# EAGLE design 2te4x230_In_3.4 (EAGLE 5.00)
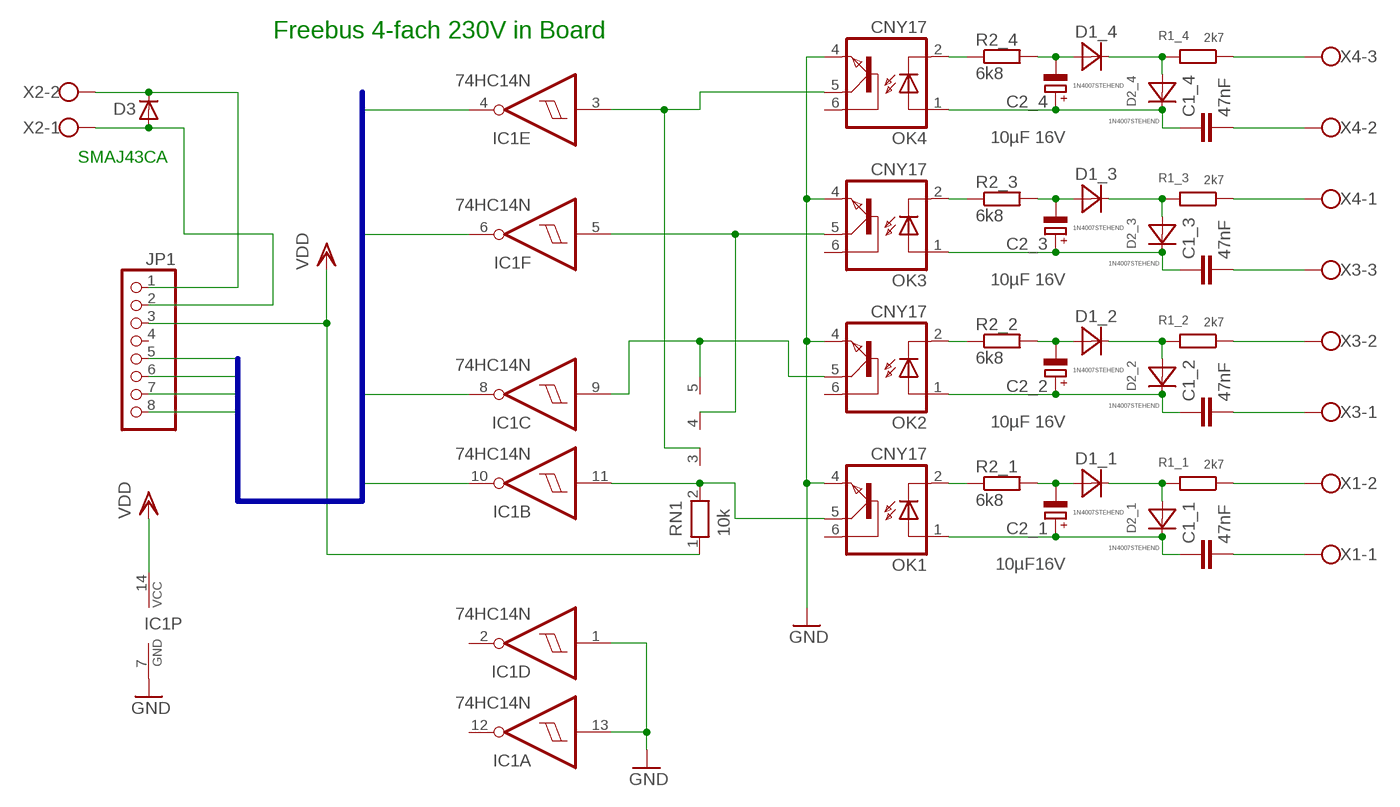
[diagram p0: schematic, sheet 1]

## Parts
C1_1  47nF  C-EU075-063X106  [C075-063X106]
C1_2  47nF  C-EU075-063X106  [C075-063X106]
C1_3  47nF  C-EU075-063X106  [C075-063X106]
C1_4  47nF  C-EU075-063X106  [C075-063X106]
C2_1  10µF16V  CPOL-EUE2-4  [E2-4]
C2_2  10µF 16V  CPOL-EUE2-4  [E2-4]
C2_3  10µF 16V  CPOL-EUE2-4  [E2-4]
C2_4  10µF 16V  CPOL-EUE2-4  [E2-4]
D1_1  1N4007STEHEND  [RAD2,5]
D1_2  1N4007STEHEND  [RAD2,5]
D1_3  1N4007STEHEND  [RAD2,5]
D1_4  1N4007STEHEND  [RAD2,5]
D2_1  1N4007STEHEND  [RAD2,5]
D2_2  1N4007STEHEND  [RAD2,5]
D2_3  1N4007STEHEND  [RAD2,5]
D2_4  1N4007STEHEND  [RAD2,5]
D3  D-SMB  [SMB]
IC1  74HC14N  [DIL14]
JP1  PINHD-1X8  [1X08]
OK1  CNY17  [DIL06]
OK2  CNY17  [DIL06]
OK3  CNY17  [DIL06]
OK4  CNY17  [DIL06]
R1_1  2k7  R-EU_0207/2V  [0207/2V]
R1_2  2k7  R-EU_0207/2V  [0207/2V]
R1_3  2k7  R-EU_0207/2V  [0207/2V]
R1_4  2k7  R-EU_0207/2V  [0207/2V]
R2_1  6k8  R-EU_0207/2V  [0207/2V]
R2_2  6k8  R-EU_0207/2V  [0207/2V]
R2_3  6k8  R-EU_0207/2V  [0207/2V]
R2_4  6k8  R-EU_0207/2V  [0207/2V]
RN1  10k  RN04  [RN-5]
X1  W237-02P  [W237-132]
X2  W237-02P  [W237-132]
X3  W237-3E  [W237-3E]
X4  W237-3E  [W237-3E]

## Nets
230+_1: C1_1.1 C2_1.+ D2_1.C OK1.1(A)
230+_2: C1_2.1 C2_2.+ D2_2.C OK2.1(A)
230+_3: C1_3.1 C2_3.+ D2_3.C OK3.1(A)
230+_4: C1_4.1 C2_4.+ D2_4.C OK4.1(A)
230-_1: C2_1.- D1_1.A R2_1.2
230-_2: C2_2.- D1_2.A R2_2.2
230-_3: C2_3.- D1_3.A R2_3.2
230-_4: C2_4.- D1_4.A R2_4.2
230N_1: D1_1.C D2_1.A R1_1.2
230N_2: D1_2.C D2_2.A R1_2.2
230N_3: D1_3.C D2_3.A R1_3.2
230N_4: D1_4.C D2_4.A R1_4.2
GND: D3.2(A) IC1.1(D:I) IC1.7(P:GND) IC1.13(A:I) JP1.2 OK1.4(EMI) OK2.4(EMI) OK3.4(EMI) OK4.4(EMI) X2.1
IO1: IC1.10(B:O) JP1.8
IO2: IC1.8(C:O) JP1.7
IO3: IC1.6(F:O) JP1.6
IO4: IC1.4(E:O) JP1.5
N$1: C1_1.2 X1.1
N$2: R1_1.1 X1.2
N$4: D3.1(C) JP1.1 X2.2
N$5: C1_2.2 X3.1
N$6: R1_2.1 X3.2
N$7: C1_3.2 X3.3
N$8: R1_3.1 X4.1
N$9: C1_4.2 X4.2
N$10: R1_4.1 X4.3
N$17: IC1.11(B:I) OK1.5(COL) RN1.2
N$19: IC1.9(C:I) OK2.5(COL) RN1.5
N$31: IC1.5(F:I) OK3.5(COL) RN1.4
N$37: IC1.3(E:I) OK4.5(COL) RN1.3
OPT_1: OK1.2(C) R2_1.1
OPT_2: OK2.2(C) R2_2.1
OPT_3: OK3.2(C) R2_3.1
OPT_4: OK4.2(C) R2_4.1
VDD: IC1.14(P:VCC) JP1.3 RN1.1
Unconnected: IC1.2(D:O) IC1.12(A:O) JP1.4 OK1.6(BAS) OK2.6(BAS) OK3.6(BAS) OK4.6(BAS)

## Buses
IO[1..8]

## Notes on the sheet
- Freebus 4-fach 230V in Board
- SMAJ43CA

## Library data of the parts
C1_1-C1_4 = rcl:C-EU: CAPACITOR, European symbol
C2_1-C2_4 = rcl:CPOL-EU: POLARIZED CAPACITOR, European symbol
D1_1-D1_4 D2_1-D2_4 = diode:1N4007
D3 = semicon-smd-ipc:D-: DIODE unfilled
IC1 = 74xx-eu:74*14: Hex schmitt trigger INVERTER
JP1 = pinhead:PINHD-1X8: PIN HEADER
OK1-OK4 = optocoupler:CNY17: SIEMENS OPTO COUPLER
R1_1-R1_4 R2_1-R2_4 = rcl:R-EU_: RESISTOR, European symbol
RN1 = resistor-net:RN04: RESISTOR NETWORK
X1 X2 = con-wago-508:W237-02P: WAGO SREW CLAMP
X3 X4 = con-wago-508:W237-3E: WAGO SREW CLAMP

## Board
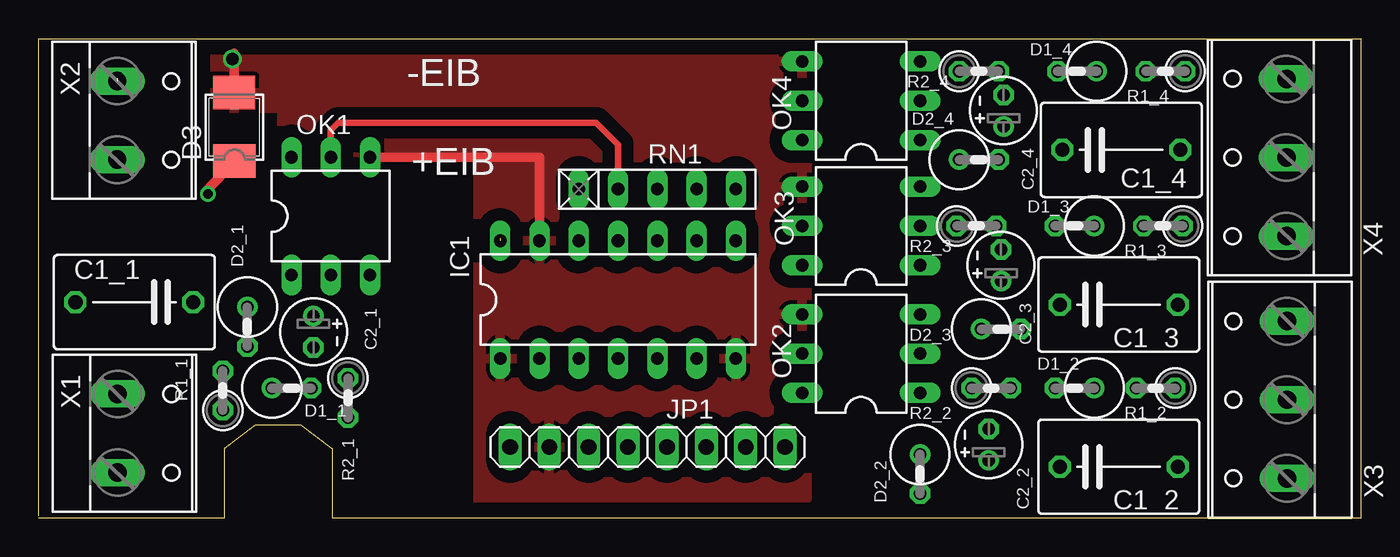
[diagram p1: board, top side]
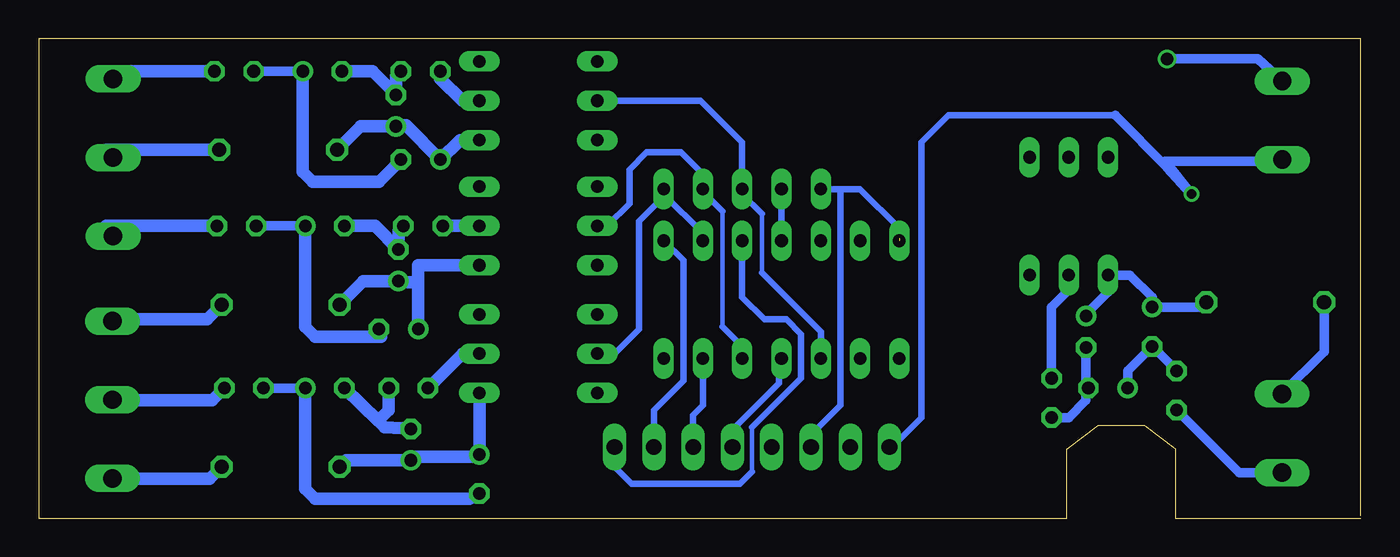
[diagram p2: board, bottom side, seen from below]

Size 85.5 x 31 mm. Coordinates in mm from the lower left corner, seen from the top.
Outline: 0.01,0.16 0.01,31 85.5,31 85.5,0 19,0 19,4.5 18.99,4.51 16.99,6.01 14.01,6.01 14.01,6 12,4.49 12,0 0,0
Copper layers (1*16): Top 0.035mm / dielectric 1.5mm / Bottom 0.035mm
Design rules "default": minimum track width 10mil, minimum drill 24mil, track to track 8mil, track to pad 8mil, pad to pad 8mil, via to via 8mil, smd to smd 8mil, copper to edge 40mil, drill to drill 8mil, minimum pad ring 10mil, minimum via ring 8mil, stop-mask expansion 4mil, vias tented up to drill 0mil, thermal gap 10mil
bRestrict: area 22.7,11.2 to 27.7,16.2

### Footprints (pad centres in the part's own frame; a part is rotated, then mirrored left to right if it is on the bottom)
C075-063X106 = drill 0.914 octagon: 1 -3.81,0; 2 3.81,0
E2-4 = drill 0.813 pad 1.27 round: + -1.016,0 | drill 0.813 pad 1.27 octagon: - 1.016,0
RAD2,5 = drill 0.813 octagon: A 1.27,0 | drill 0.813 round: C -1.27,0
SMB = smd 2.159 x 2.743: 1 -2.311,-0.127; 2 2.108,-0.102
DIL14 = drill 0.813 long: 1 -7.62,-3.81; 2 -5.08,-3.81; 3 -2.54,-3.81; 4 0,-3.81; 5 2.54,-3.81; 6 5.08,-3.81; 7 7.62,-3.81; 8 7.62,3.81; 9 5.08,3.81; 10 2.54,3.81; 11 0,3.81; 12 -2.54,3.81; 13 -5.08,3.81; 14 -7.62,3.81
1X08 = drill 1.016 long: 1 -8.89,0; 2 -6.35,0; 3 -3.81,0; 4 -1.27,0; 5 1.27,0; 6 3.81,0; 7 6.35,0; 8 8.89,0
DIL06 = drill 0.813 long: 1 -2.54,-3.81; 2 0,-3.81; 3 2.54,-3.81; 4 2.54,3.81; 5 0,3.81; 6 -2.54,3.81
0207/2V = drill 0.813 octagon: 1 -1.27,0; 2 1.27,0
RN-5 = drill 0.813 long: 1 -5.08,0; 2 -2.54,0; 3 0,0; 4 2.54,0; 5 5.08,0
W237-132 = drill 1.194 long: 1 -2.54,-0.635; 2 2.54,-0.635
W237-3E = drill 1.194 long: 1 -5.08,-0.635; 2 0,-0.635; 3 5.08,-0.635

### Placement (x,y rotation side)
C1_1  6.19,13.97 180 top
C1_2  69.85,3.34 0 top
C1_3  69.85,13.81 0 top
C1_4  70.01,23.81 0 top
C2_1  17.78,12.07 270 top
C2_2  61.44,4.76 90 top
C2_3  62.23,16.35 90 top
C2_4  62.39,26.35 90 top
D1_1  16.35,8.42 0 top
D1_2  66.99,8.42 180 top
D1_3  66.99,18.89 180 top
D1_4  67.15,28.89 180 top
D2_1  13.49,12.38 270 top
D2_2  56.99,2.86 270 top
D2_3  62.23,12.23 0 top
D2_4  60.8,23.18 0 top
D3  12.54,25.4 90 top
IC1  37.46,14.13 0 top
JP1  39.37,4.61 0 top
OK1  18.89,19.53 0 top
OK2  53.18,10.64 90 top
OK3  53.18,18.89 90 top
OK4  53.18,26.99 90 top
R1_1  11.91,8.26 90 top
R1_2  72.23,8.42 180 top
R1_3  72.71,18.89 180 top
R1_4  72.87,28.89 180 top
R2_1  20,7.78 270 top
R2_2  61.59,8.42 0 top
R2_3  60.64,18.89 0 top
R2_4  60.8,28.89 0 top
RN1  40,21.27 0 top
X1  5.74,5.49 270 top
X2  5.71,25.72 270 top
X3  80.1,7.66 90 top
X4  80.05,23.32 90 top

### Tracks (layer width: path | path; a pad name or v marks a point on that pad's centre or on a via)
230+_1
  Bottom 0.61: C1_1.1 10.32,13.65 D2_1.C 13.49,14.29 14.92,15.72 OK1.1 | OK1.1 | C2_1.+ 17.78,13.18 16.35,14.61 OK1.1
230+_2
  Bottom 0.813: OK2.1 56.99,6.99 D2_2.C 57.15,3.97 61.28,3.97 arc-90 61.44,3.81 C2_2.+ 65.63,3.75 C1_2.1 | C1_2.1
230+_3
  Bottom 0.813: OK3.1 60.96,16.35 D2_3.C 60.96,15.24 61.59,15.24 C2_3.+ 64.52,15.34 C1_3.1
230+_4
  Bottom 0.813: OK4.1 58.26,24.45 D2_4.C 61.75,25.4 62.39,25.4 C2_4.+ 64.67,25.34 C1_4.1
230-_1
  Bottom 0.61: C2_1.- | D1_1.A 17.78,8.57 | 17.78,8.57 C2_1.- | 17.78,8.57 17.78,7.62 18.89,6.51 R2_1.2
230-_2
  Bottom 0.813: 61.44,5.88 C2_2.- 63.12,5.88 63.55,6.3 | R2_2.2 62.86,6.99 63.55,6.3 | 63.55,6.3 D1_2.A
230-_3
  Bottom 0.813: C2_3.- 62.23,17.31 | R2_3.2 62.23,18.58 C2_3.- | C2_3.- 63.75,18.89 D1_3.A
230-_4
  Bottom 0.813: C2_4.- 62.39,27.31 | R2_4.2 62.39,28.58 C2_4.- | C2_4.- 63.91,28.89 D1_4.A
230N_1
  Bottom 0.61: R1_1.2 D2_1.A 15.08,9.53 D1_1.C | D1_1.C
230N_2
  Bottom 0.61: D1_2.C R1_2.2
  Bottom 0.813: D1_2.C 68.26,1.91 67.63,1.27 57.62,1.27 D2_2.A
230N_3
  Bottom 0.61: D1_3.C R1_3.2
  Bottom 0.813: D1_3.C 68.26,12.38 67.63,11.75 63.34,11.75 D2_3.A
230N_4
  Bottom 0.61: D1_4.C R1_4.2
  Bottom 0.813: D1_4.C 68.42,22.39 67.78,21.75 63.5,21.75 D2_4.A
GND  (via drill 0.8)
  Top 0.61: OK1.4 32.38,23.34 IC1.13 | v12.54,29.69 12.64,30.06 D3.2
  Bottom 0.406: OK4.4 49.69,29.53
  Bottom 0.61: X2.1 6.67,29.69 v12.54,29.69
  pour Top (isolate 0.813): 28.42,1.43 28.42,23.5 28.26,23.66 15.72,23.66 15.72,26.51 11.43,26.51 11.43,30.64 11.59,30.48 49.37,30.48 49.69,30.16 49.69,1.27 49.53,1.11 28.42,1.11
IO1
  Bottom 0.305: 39.37,3.02 39.37,5.88
  Bottom 0.406: IC1.10 | IC1.10 40,14.29 38.58,12.86 37.15,12.86 36.19,11.91 36.19,9.05 39.37,5.88 | 39.37,3.02 40.16,2.22 47.15,2.22 48.26,3.34 JP1.8 | JP1.8
IO2
  Bottom 0.406: IC1.8 43.81,16.67 43.81,8.89 45.72,6.99 JP1.7 | JP1.7 45.72,4.45 | JP1.7
IO3
  Bottom 0.406: IC1.6 | IC1.6 42.54,7.3 43.18,6.67 JP1.6 | JP1.6
IO4
  Bottom 0.406: IC1.4 37.62,10.16 37.62,8.73 40.64,5.72 JP1.5 | JP1.5
N$1
  Bottom 0.61: X1.1 2.38,10.76 C1_1.2
N$2
  Bottom 0.61: R1_1.1 | X1.2 7.87,2.95 R1_1.1
N$4  (via drill 0.6)
  Top 0.61: v10.95,20.96 10.76,21.08 D3.1
  Bottom 0.406: JP1.1 | JP1.1 30.32,4.61 28.41,6.51 28.41,24.29 26.67,26.04 15.87,26.04
  Bottom 0.61: 15.87,26.04 12.54,22.7 v10.95,20.96 12.54,22.96 D3.1 5.17,23.09 X2.2
N$5
  Bottom 0.406: 81.25,2.54 arc-90 X3.1
  Bottom 0.813: 81.25,2.54 81.28,2.54 | 81.25,2.54 X3.1 | C1_2.2 74.45,2.54 81.25,2.54
N$6
  Bottom 0.406: 81.17,7.62 arc90 X3.2
  Bottom 0.813: X3.2 81.17,7.62 74.29,7.62 R1_2.1
N$7
  Bottom 0.406: 81.28,12.86 81.28,12.81 arc-90 X3.3
  Bottom 0.813: 81.28,12.86 74.61,12.86 C1_3.2
N$8
  Bottom 0.813: X4.1 81.12,18.24 81.12,18.89 R1_3.1
N$9
  Bottom 0.406: 81.12,23.18 81.12,23.32 X4.2
  Bottom 0.813: C1_4.2 81.12,23.81 81.12,23.32
N$10
  Bottom 0.406: 81.12,28.4 X4.3
  Bottom 0.813: R1_4.1 81.12,28.89 81.12,28.4
N$17
  Top 0.406: OK1.5 | OK1.5 18.89,25.08 19.37,25.56 36.04,25.56 37.46,24.13 RN1.2
  Bottom 0.406: RN1.2 | IC1.11 | RN1.2 IC1.11 | 37.46,21.43 | RN1.2 37.46,21.43
N$19
  Bottom 0.406: IC1.9 42.54,18.42 45.08,20.96 | RN1.5 | RN1.5 | IC1.9 | OK2.5 48.26,10.64 46.67,12.23 46.67,19.21 45.08,20.8 45.08,20.96 | RN1.5 | RN1.5 | 45.08,20.96 RN1.5
N$31
  Bottom 0.305: 41.27,12.38 41.27,19.85
  Bottom 0.406: IC1.5 40,11.11 41.27,12.38 | 42.54,21.12 | 42.54,21.12 RN1.4 42.54,22.23 43.97,23.66 46.2,23.66 47.31,22.54 47.31,20.32 48.73,18.89 OK3.5 | 41.27,19.85 42.54,21.12
N$37
  Bottom 0.305: 38.73,15.88 38.73,19.69
  Bottom 0.406: RN1.3 40,20.96 38.73,19.69 | RN1.3 | RN1.3 40,24.29 42.7,26.99 OK4.5 | 38.73,15.88 34.92,12.07 IC1.3 | IC1.3
OPT_1
  Bottom 0.61: R2_1.1 20,13.65 18.89,14.77 OK1.2 | OK1.2
OPT_2
  Bottom 0.813: OK2.2 58.1,10.64 R2_2.1 | R2_2.1
OPT_3
  Bottom 0.813: OK3.2 58.1,18.89 58.58,18.89 R2_3.1
OPT_4
  Bottom 0.813: OK4.2 58.1,26.99 59.53,28.42 R2_4.1
VDD  (1 unrouted)
  Bottom 0.406: 29.84,18.1 29.84,18.73 32.38,21.27 RN1.1 34.77,21.27 33.65,21.27 33.65,7.3 35.56,5.4 JP1.3

### Text on the board
tPlace: -EIB | +EIB